# Altium schematic sheet Sheet1.SchDoc
size A3
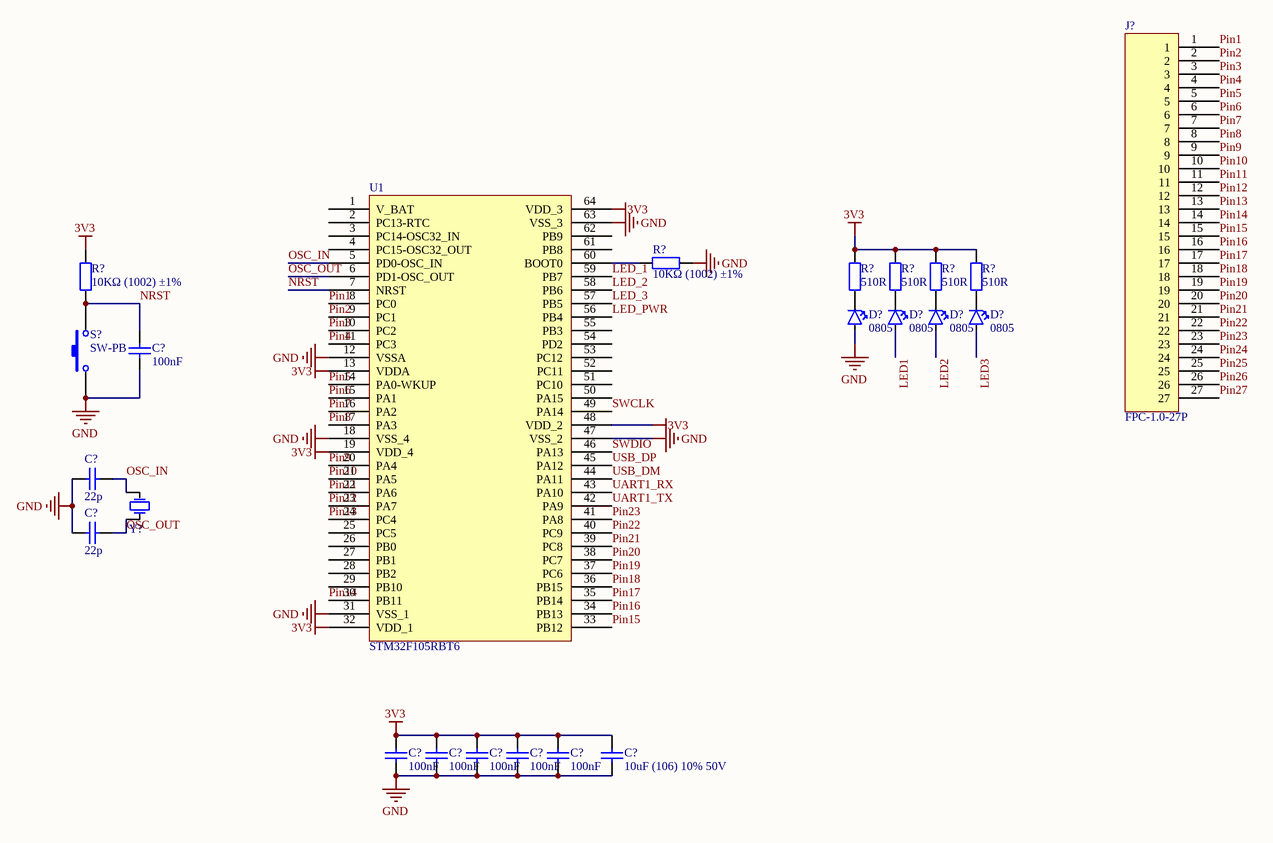
[diagram p0: Sheet1.SchDoc]

## Parts
(Parts that share a designator on the sheet are numbered #1, #2 ... from top to bottom, then left to right.)
C?#1  100nF  [0603_C]
C?#2  22p  [0603_C]
C?#3  22p  [0603_C]
C?#4  100nF  [0603_C]
C?#5  100nF  [0603_C]
C?#6  100nF  [0603_C]
C?#7  100nF  [0603_C]
C?#8  100nF  [0603_C]
C?#9  10uF (106) 10% 50V  [1206_C]
D?#1  0805  [0805-LED]
D?#2  0805  [0805-LED]
D?#3  0805  [0805-LED]
D?#4  0805  [0805-LED]
J?  FPC-1.0-27P  [FPC-1.0-27P]
R?#1  10KΩ (1002) ±1%  [0603_R]
R?#2  10KΩ (1002) ±1%  [0603_R]
R?#3  510R  [0603_R]
R?#4  510R  [0603_R]
R?#5  510R  [0603_R]
R?#6  510R  [0603_R]
S?  SW-PB  [SW_PB2_A1]
U1  STM32F105RBT6  [LQFP-64_10x10x05P]
Y?  XTAL  [X-HC49U]  (value not drawn)

## Nets
3V3: C?#4.2 C?#5.2 C?#6.2 C?#7.2 C?#8.2 C?#9.2 R?#2.2 R?#3.2 R?#4.2 R?#5.2 R?#6.2 U1.13(VDDA) U1.19(VDD_4) U1.32(VDD_1) U1.48(VDD_2) U1.64(VDD_3)
GND: C?#1.1 C?#2.1 C?#3.1 C?#4.1 C?#5.1 C?#6.1 C?#7.1 C?#8.1 C?#9.1 D?#1.2 R?#1.2 S?.1 U1.12(VSSA) U1.18(VSS_4) U1.31(VSS_1) U1.47(VSS_2) U1.63(VSS_3)
LED1: D?#2.2
LED2: D?#3.2
LED3: D?#4.2
LED_1: U1.59(PB7)
LED_2: U1.58(PB6)
LED_3: U1.57(PB5)
LED_PWR: U1.56(PB4)
NRST: C?#1.2 R?#2.1 S?.2 U1.7(NRST)
OSC_IN: C?#2.2 U1.5(PD0-OSC_IN) Y?.1(OSC1)
OSC_OUT: C?#3.2 U1.6(PD1-OSC_OUT) Y?.2(OSC2)
Pin1: J?.1 U1.8(PC0)
Pin2: J?.2 U1.9(PC1)
Pin3: J?.3 U1.10(PC2)
Pin4: J?.4 U1.11(PC3)
Pin5: J?.5 U1.14(PA0-WKUP)
Pin6: J?.6 U1.15(PA1)
Pin7: J?.7 U1.16(PA2)
Pin8: J?.8 U1.17(PA3)
Pin9: J?.9 U1.20(PA4)
Pin10: J?.10 U1.21(PA5)
Pin11: J?.11 U1.22(PA6)
Pin12: J?.12 U1.23(PA7)
Pin13: J?.13 U1.24(PC4)
Pin14: J?.14 U1.30(PB11)
Pin15: J?.15 U1.33(PB12)
Pin16: J?.16 U1.34(PB13)
Pin17: J?.17 U1.35(PB14)
Pin18: J?.18 U1.36(PB15)
Pin19: J?.19 U1.37(PC6)
Pin20: J?.20 U1.38(PC7)
Pin21: J?.21 U1.39(PC8)
Pin22: J?.22 U1.40(PC9)
Pin23: J?.23 U1.41(PA8)
Pin24: J?.24
Pin25: J?.25
Pin26: J?.26
Pin27: J?.27
SWCLK: U1.49(PA14)
SWDIO: U1.46(PA13)
UART1_RX: U1.43(PA10)
UART1_TX: U1.42(PA9)
USB_DM: U1.44(PA11)
USB_DP: U1.45(PA12)
NetD?#1_1: D?#1.1 R?#3.1
NetD?#2_1: D?#2.1 R?#4.1
NetD?#3_1: D?#3.1 R?#5.1
NetD?#4_1: D?#4.1 R?#6.1
NetR?#1_1: R?#1.1 U1.60(BOOT0)

Not connected (* = marked no-connect by the designer): U1 1(V_BAT) 2(PC13-RTC) 3(PC14-OSC32_IN) 4(PC15-OSC32_OUT) 25(PC5) 26(PB0) 27(PB1) 28(PB2) 29(PB10) 50(PA15) 51(PC10) 52(PC11) 53(PC12) 54(PD2) 55(PB3) 61(PB8) 62(PB9)

## Library data of the parts
C?#1-C?#8 = 0603 100nF (104) 10% 50V: 贴片电容; ComponentLink1Description: 供应商链接; ComponentLink1URL: http://www.szlcsc.com/product/details_15331.html; Package: 0603; Supplier: LC; SuppliersPartNumber: C14663
C?#9 = 1206 10uF (106) 10% 50V: 贴片电容; ComponentLink1Description: 供应商链接; ComponentLink1URL: http://www.szlcsc.com/product/details_14236.html; Package: 1206; Supplier: LC; SuppliersPartNumber: C13585
D?#1-D?#4 = LED0805
R?#1-R?#6 = 0603 10KΩ (1002) 1%: 贴片电阻; ComponentLink1Description: 供应商链接; ComponentLink1URL: http://www.szlcsc.com/product/details_26547.html; Package: 0603; Supplier: LC; SuppliersPartNumber: C25804
S? = SW-PB: 微动开关; Published: 24-Mar-1999; LatestRevisionDate: 17-Jul-2002; LatestRevisionNote: Re-released for DXP Platform.; PackageReference: SPST-2; Publisher: Altium Limited
Y? = XTAL: 晶振; Published: 8-Jun-2000; LatestRevisionDate: 17-Jul-2002; LatestRevisionNote: Re-released for DXP Platform.; PackageReference: R38; Publisher: Altium Limited